# EasyEDA schematic SCH_cam_2026-07-08.json
TITLE: Sheet_1; REV: 1.0; Date: 2026-07-03; Sheet: 1/1; Drawn By: Maxim_ag; Company: Your Company
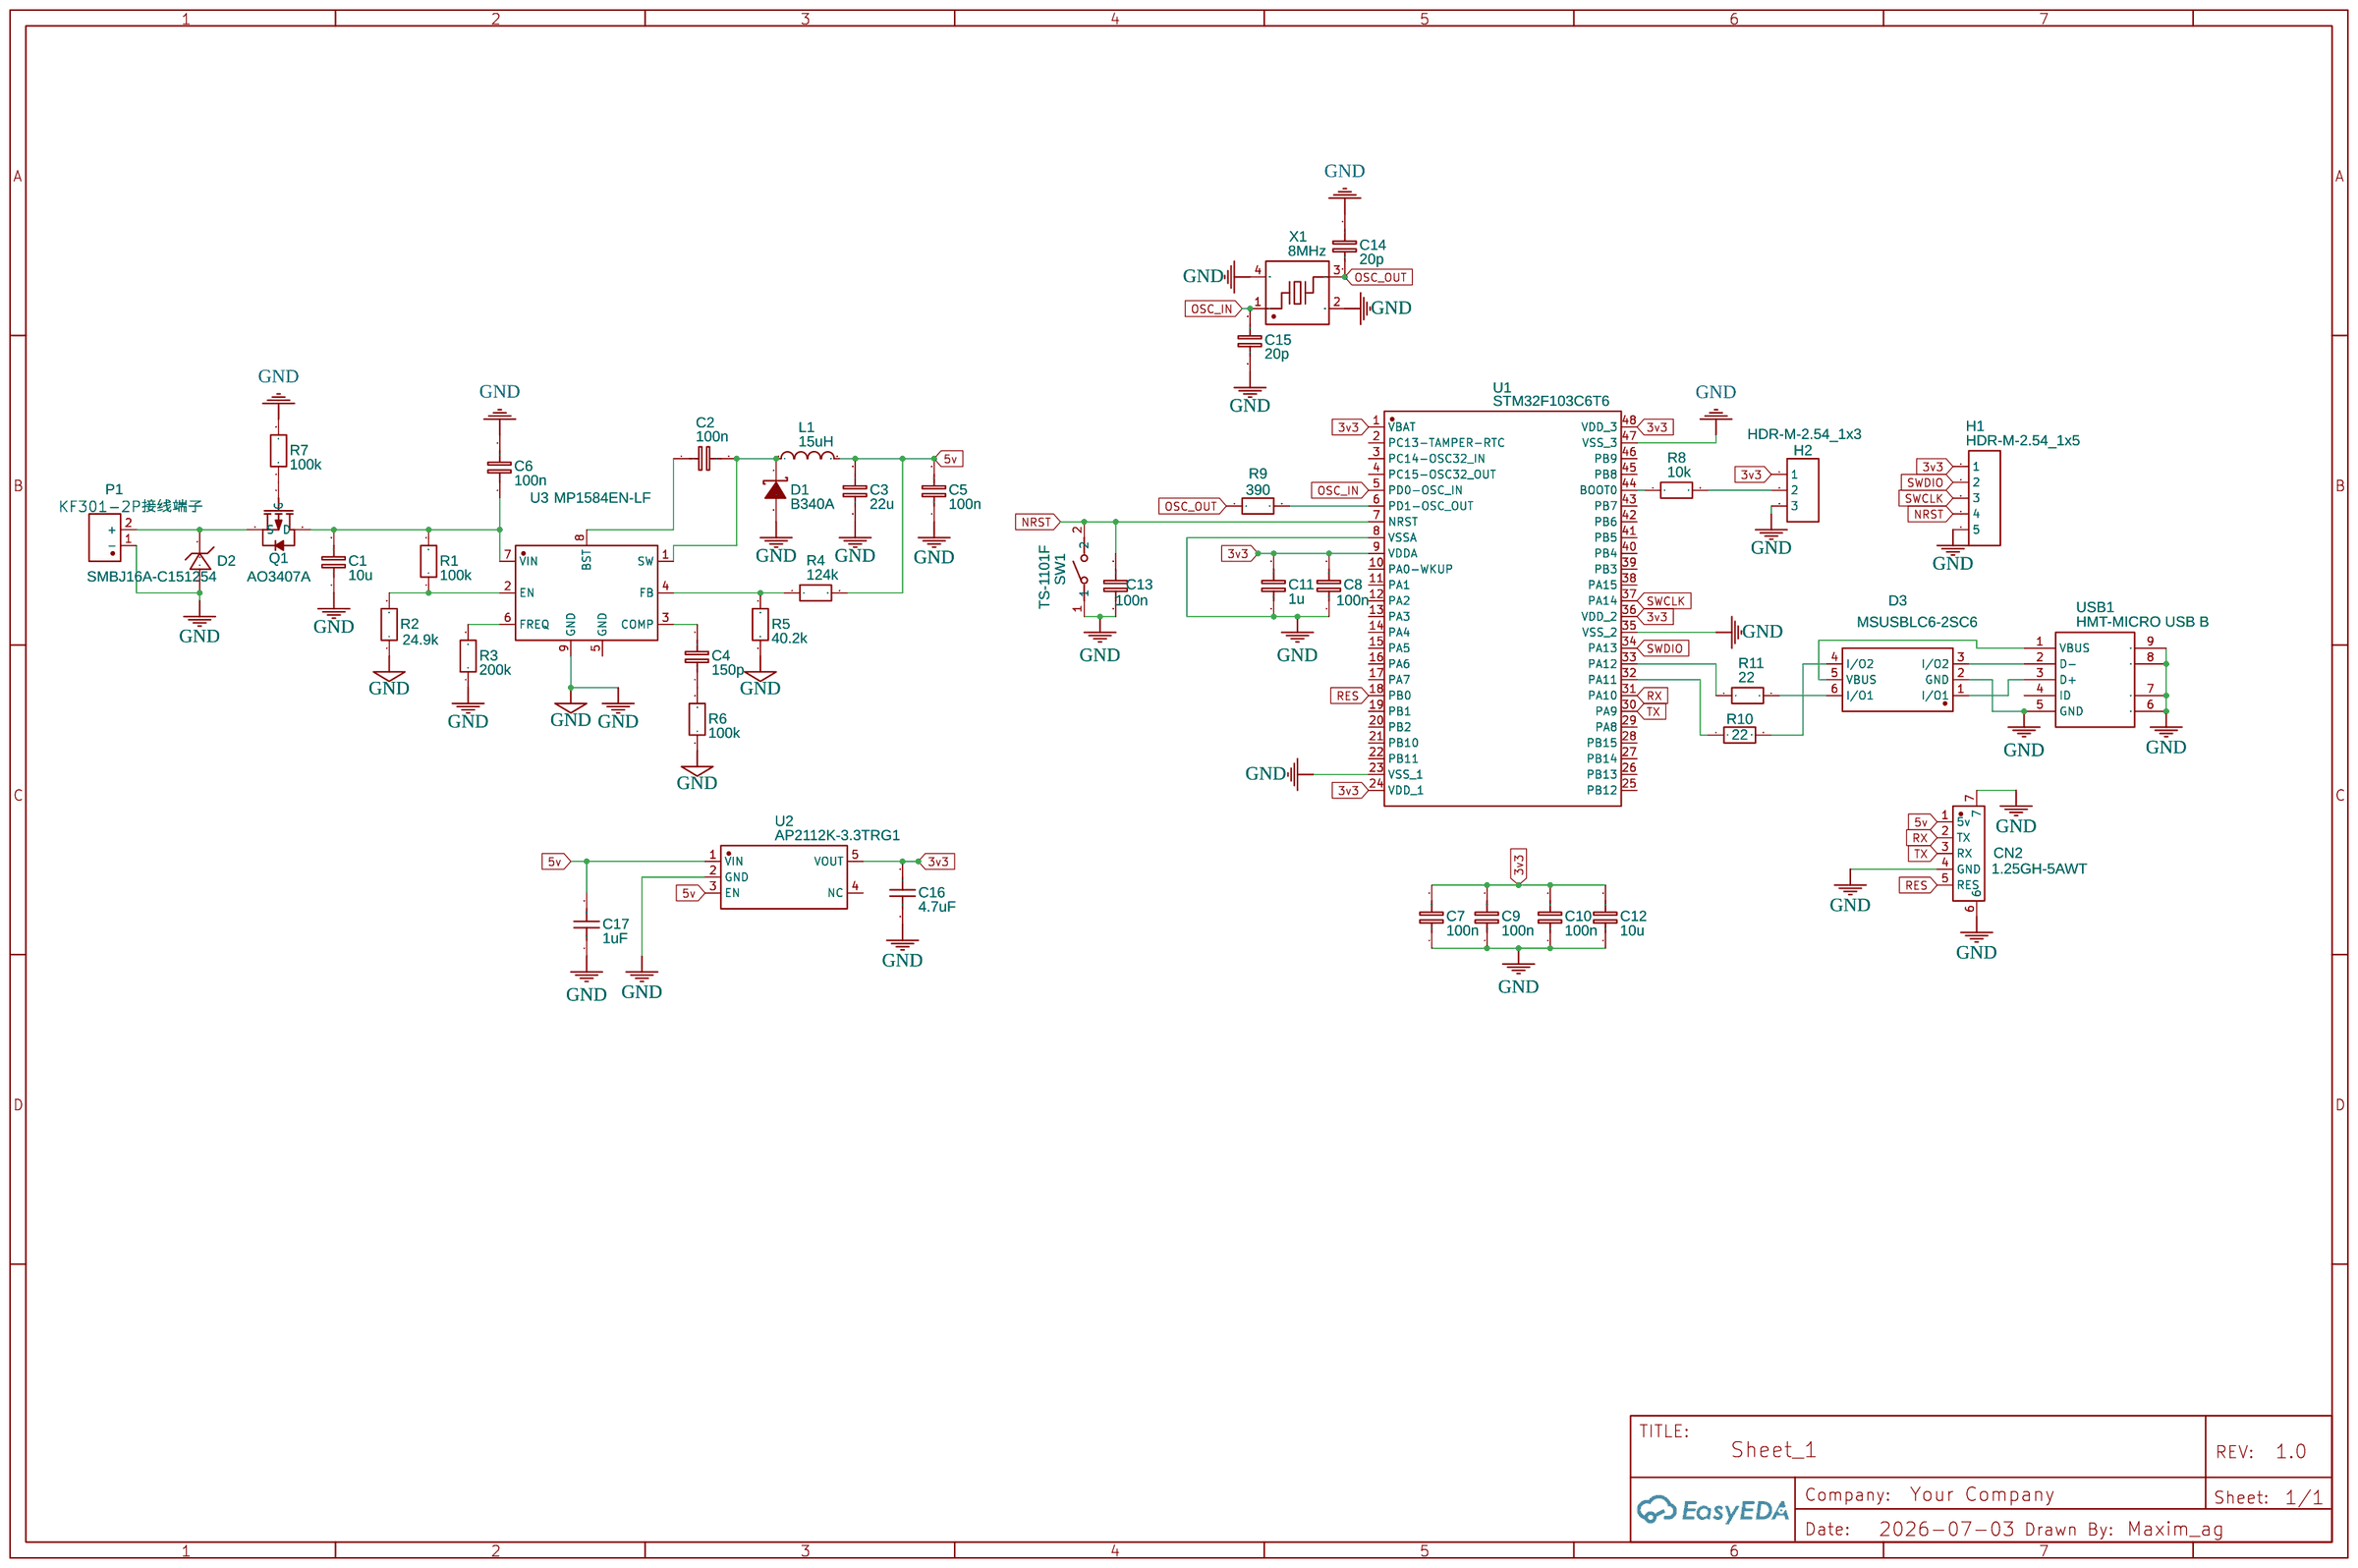
[diagram p0: schematic sheet]

## Parts
C1  10u  [C1206]
C2  100n  [C0603]
C3  22u  [C1206]
C4  150p  [C0603]
C5  100n  [C0603]
C6  100n  [C0603]
C7  100n  [C0603]
C8  100n  [C0603]
C9  100n  [C0603]
C10  100n  [C0603]
C11  1u  [C0603]
C12  10u  [C1206]
C13  100n  [C0603]
C14  20p  [C0603]
C15  20p  [C0603]
C16  4.7uF  [C0805]
C17  1uF  [C0603]
CN2  1.25GH-5AWT  [CONN-SMD_5P-P1.25_HAOYU_PH1257-WT-05]
D1  B340A  [SMA_L4.3-W2.6-LS5.1-RD]
D2  SMBJ16A-C151254  [SMB_L4.6-W3.6-LS5.3-RD]
D3  MSUSBLC6-2SC6  [SOT-23-6_L2.9-W1.6-P0.95-LS2.8-BL]
H1  HDR-M-2.54_1x5  [HDR-M-2.54_1X5]
H2  HDR-M-2.54_1x3  [HDR-M-2.54_1X3]
L1  15uH  [IND-SMD_L10.1-W10.1_SLF10145T]
P1  KF301-2P接线端子  [CONN-TH_XY301V-A-5.0-2P]
Q1  AO3407A  [SOT-23-3_L2.9-W1.6-P1.90-LS2.8-BR]
R1  100k  [R0603]
R2  24.9k  [R0603]
R3  200k  [R0603]
R4  124k  [R0603]
R5  40.2k  [R0603]
R6  100k  [R0603]
R7  100k  [R0603]
R8  10k  [R0603]
R9  390  [R0603]
R10  22  [R0603]
R11  22  [R0603]
SW1  TS-1101F  [SW2-5.0-6.0X3.0X4.3MM]
U1  STM32F103C6T6  [LQFP-48_L7.0-W7.0-P0.50-LS9.0-BL]
U2  AP2112K-3.3TRG1  [SOT-25-5_L2.9-W1.6-P0.95-LS2.8-BL]
U3  MP1584EN-LF  [SOIC-8_L4.9-W3.9-P1.27-LS6.0-BL-EP3.3-1]
USB1  HMT-MICRO USB B  [MICRO-USB-SMD_HMT-MICRO-USB-B]
X1  8MHz  [CRYSTAL-SMD_4P-L3.2-W2.5-BL]

## Library data of the parts
C1 C12 = C_1206_EU: Contributor: LCEDA_Lib
C2 C4-C11 = C_0805_EU: Contributor: LCEDA_Lib
C3 = C_1206_EU: Contributor: LCEDA_Lib; Package Display: No
C13-C15 = C_0603_EU: Contributor: LCEDA_Lib
C16 C17 = 0805X7R475K250NT: Supplier: LCSC; Supplier Part: C48579646; Manufacturer: AIDE(爱迪电容); JLCPCB Part Class: Extended Part; Contributor: lcsc
CN2 = 1.25GH-5AWT: Supplier: LCSC; Supplier Part: C46472649; Manufacturer: FG(富港); JLCPCB Part Class: Extended Part; Contributor: lcsc
D1 = B340A: Supplier: LCSC; Manufacturer: MDD(辰达半导体); Supplier Part: C64982; JLCPCB Part Class: Extended Part
D2 = SMBJ16A-C151254: Contributor: LCSC; Supplier Part: C151254; Supplier: LCSC; Manufacturer: Littelfuse(美国力特); Manufacturer Part: SMBJ16A; JLCPCB Part Class: Extended Part
D3 = MSUSBLC6-2SC6: Contributor: lcsc; Supplier: LCSC; Supplier Part: C2830148; Manufacturer: MSKSEMI(美森科); JLCPCB Part Class: Extended Part
H1 = HDR-F-2.54_1x5: Supplier Part: C50950; Supplier: LCSC; Contributor: LCEDA_Lib
H2 = HDR-F-2.54_1x3: Supplier Part: C146690; Supplier: LCSC; Contributor: LCEDA_Lib
L1 = SLF10145T-100M2R5-H: Contributor: lcsc; Supplier: LCSC; Supplier Part: C2042166; Manufacturer: TDK; JLCPCB Part Class: Extended Part
P1 = KF301-2P接线端子: Contributor: lcsc; Supplier: LCSC; Supplier Part: C9900016950; Manufacturer: null; JLCPCB Part Class: Extended Part
Q1 = AO3407A: Supplier: LCSC; Manufacturer: AOS; Supplier Part: C15155; JLCPCB Part Class: Extended Part
R1-R3 R9-R11 = R_0603_EU: Contributor: LCEDA_Lib
R4-R8 = R_0805_EU: Contributor: LCEDA_Lib
SW1 = TS-1101F: DIP Button Front -white;2P-L6.0*W3.0*H4.3mm-90D
U1 = STM32F103C6T6: Supplier: LCSC; Supplier Part: C9900147998; Manufacturer: null; JLCPCB Part Class: Extended Part; Contributor: lcsc
U2 = AP2112K-3.3TRG1: Contributor: LCSC; Supplier: LCSC; Manufacturer: DIODES(美台); Supplier Part: C51118; JLCPCB Part Class: Extended Part
U3 = MP1584EN-LF: Supplier: LCSC; Supplier Part: C21999497; Manufacturer: MPS(芯源); Contributor: lcsc
USB1 = HMT-MICRO USB B: Supplier: LCSC; Supplier Part: C53121380; Manufacturer: HMTCONN(华明通); JLCPCB Part Class: Extended Part; Contributor: lcsc
X1 = X32258MSB4SI: Contributor: LCSC; Supplier: LCSC; Supplier Part: C2682774; Manufacturer: YXC(扬兴晶振); JLCPCB Part Class: Extended Part

## Nets
3v3: C7.2 C8.2 C9.2 C10.2 C11.2 C12.2 C16.2 H1.1 H2.1 U1.1(VBAT) U1.9(VDDA) U1.24(VDD_1) U1.36(VDD_2) U1.48(VDD_3) U2.5(VOUT)
5v: C3.2 C5.2 C17.2 CN2.1(5v) L1.2 R4.2 U2.1(VIN) U2.3(EN)
GND: C1.1 C3.1 C5.1 C6.2 C7.1 C8.1 C9.1 C10.1 C11.1 C12.1 C13.1 C14.2 C15.1 C16.1 C17.1 CN2.4(GND) CN2.6 CN2.7 D1.2(A) D2.2(A) D3.2(GND) H1.5 H2.3 P1.1(-) R2.1 R3.1 R5.1 R6.1 R7.2 SW1.1 U1.8(VSSA) U1.23(VSS_1) U1.35(VSS_2) U1.47(VSS_3) U2.2(GND) U3.9(GND) USB1.5(GND) USB1.6(EH) USB1.7(EH) USB1.8(EH) USB1.9(EH) X1.2(GND) X1.4(GND)
NRST: C13.2 H1.4 SW1.2 U1.7(NRST)
OSC_IN: C15.2 U1.5(PD0-OSC_IN) X1.1
OSC_OUT: C14.1 R9.1 X1.3
RES: CN2.5(RES) U1.18(PB0)
RX: CN2.2(TX) U1.31(PA10)
SWCLK: H1.3 U1.37(PA14)
SWDIO: H1.2 U1.34(PA13)
TX: CN2.3(RX) U1.30(PA9)
Net-(C1-2): C1.2 C6.1 Q1.3(D) R1.2 U3.7(VIN)
Net-(C2-1): C2.1 U3.8(BST)
Net-(C2-2): C2.2 D1.1(K) L1.1 U3.1(SW)
Net-(C4-1): C4.1 R6.2
Net-(C4-2): C4.2 U3.3(COMP)
Net-(D2-1): D2.1(C) P1.2(+) Q1.2(S)
Net-(D3-1): D3.1(I/O1) USB1.3(D+)
Net-(D3-3): D3.3(I/O2) USB1.2(D-)
Net-(D3-4): D3.4(I/O2) R10.2
Net-(D3-5): D3.5(VBUS) USB1.1(VBUS)
Net-(D3-6): D3.6(I/O1) R11.2
Net-(H2-2): H2.2 R8.2
Net-(Q1-1): Q1.1(G) R7.1
Net-(R1-1): R1.1 R2.2 U3.2(EN)
Net-(R3-2): R3.2 U3.6(FREQ)
Net-(R4-1): R4.1 R5.2 U3.4(FB)
Net-(R8-1): R8.1 U1.44(BOOT0)
Net-(R9-2): R9.2 U1.6(PD1-OSC_OUT)
Net-(R10-1): R10.1 U1.32(PA11)
Net-(R11-1): R11.1 U1.33(PA12)

Not connected (* = marked no-connect by the designer): U1 2(PC13-TAMPER-RTC) 3(PC14-OSC32_IN) 4(PC15-OSC32_OUT) 10(PA0-WKUP) 11(PA1) 12(PA2) 13(PA3) 14(PA4) 15(PA5) 16(PA6) 17(PA7) 19(PB1) 20(PB2) 21(PB10) 22(PB11) 25(PB12) 26(PB13) 27(PB14) 28(PB15) 29(PA8) 38(PA15) 39(PB3) 40(PB4) 41(PB5) 42(PB6) 43(PB7) 45(PB8) 46(PB9); U2 4(NC); U3 5(GND); USB1 4(ID)
